# Altium schematic sheet PowerSupply_Schematic.SchDoc
size A3; SheetNumber: 1; SheetTotal: 3; SPICEModelCacheCBIUOFXF: <root> / <DocumentId>CBIUOFXF</DocumentId> / <CacheFrame Number="0"> / <Model Name="860020375017_1mf" Kind="CKT"> / <Text>******* / .subckt 860020375017_1mF 1 2 / Rser 1 3 0.071 / Lser 2 4 0.0000000243 / C1 3 4 0.001 / Rpar 3 4 100000 / .ends 860020375017_1mF</Text> / </Model> / <Model Name="860020372001_10uf" Kind="CKT"> / <Text>******* / .subckt 860020372001_10uF 1 2 / Rser 1 3 1.95182658193 / Lser 2 4 4.159236184E-09 / C1 3 4 0.00001 / Rpar 3 4 5333333.33333333 / .ends 860020372001_10uF</Text> / </Model> / </CacheFrame> / </root>
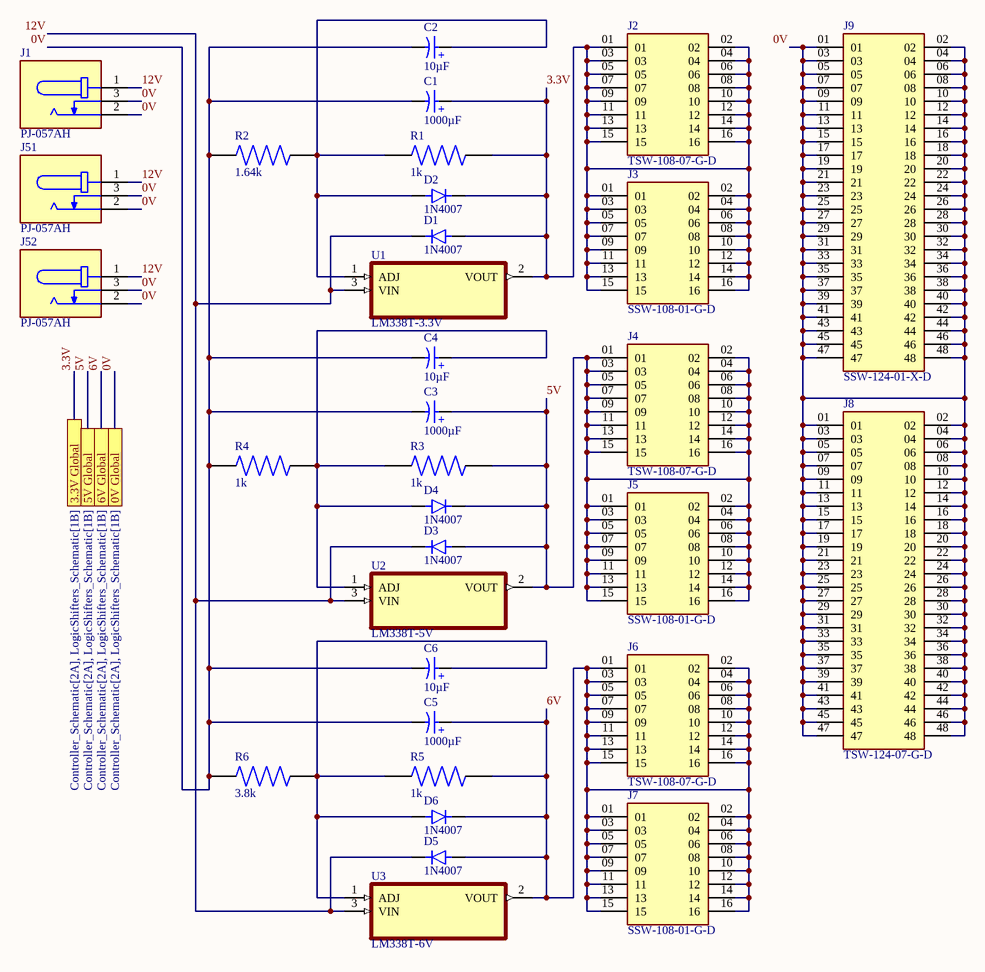
[diagram p0: PowerSupply_Schematic.SchDoc]

## Parts
C1  1000µF  [WCAP-ATG5_D10H12.5]
C2  10µF  [WCAP-ATG5_D5H11]
C3  1000µF  [WCAP-ATG5_D10H12.5]
C4  10µF  [WCAP-ATG5_D5H11]
C5  1000µF  [WCAP-ATG5_D10H12.5]
C6  10µF  [WCAP-ATG5_D5H11]
D1  1N4007  [DIOAD1060W80L520D270]
D2  1N4007  [DIOAD1060W80L520D270]
D3  1N4007  [DIOAD1060W80L520D270]
D4  1N4007  [DIOAD1060W80L520D270]
D5  1N4007  [DIOAD1060W80L520D270]
D6  1N4007  [DIOAD1060W80L520D270]
J1  PJ-057AH  [CUI_PJ-057AH]
J2  TSW-108-07-G-D  [SAMTEC_TSW-108-07-G-D]
J3  SSW-108-01-G-D  [SAMTEC_SSW-108-01-G-D]
J4  TSW-108-07-G-D  [SAMTEC_TSW-108-07-G-D]
J5  SSW-108-01-G-D  [SAMTEC_SSW-108-01-G-D]
J6  TSW-108-07-G-D  [SAMTEC_TSW-108-07-G-D]
J7  SSW-108-01-G-D  [SAMTEC_SSW-108-01-G-D]
J8  TSW-124-07-G-D  [SAMTEC_TSW-124-07-G-D]
J9  SSW-124-01-X-D  [SAMTEC_SSW-124-01-X-D]
J51  PJ-057AH  [CUI_PJ-057AH]
J52  PJ-057AH  [CUI_PJ-057AH]
R1  1k  [RESAD700W45L350D185]
R2  1.64k  [RESAD700W45L350D185]
R3  1k  [RESAD700W45L350D185]
R4  1k  [RESAD700W45L350D185]
R5  1k  [RESAD700W45L350D185]
R6  3.8k  [RESAD700W45L350D185]
U1  LM338T-3.3V  [TO254P1054X470X1955-3]
U2  LM338T-5V  [TO254P1054X470X1955-3]
U3  LM338T-6V  [TO254P1054X470X1955-3]

## Ports
0V Global (see Controller_Schematic[2A], LogicShifters_Schematic[1B]), 3.3V Global (see Controller_Schematic[2A], LogicShifters_Schematic[1B]), 5V Global (see Controller_Schematic[2A], LogicShifters_Schematic[1B]), 6V Global (see Controller_Schematic[2A], LogicShifters_Schematic[1B])

## Nets
0V: C1.2(N) C2.2(N) C3.2(N) C4.2(N) C5.2(N) C6.2(N) J1.2 J1.3 J8.01 J8.02 J8.03 J8.04 J8.05 J8.06 J8.07 J8.08 J8.09 J8.10 J8.11 J8.12 J8.13 J8.14 J8.15 J8.16 J8.17 J8.18 J8.19 J8.20 J8.21 J8.22 J8.23 J8.24 J8.25 J8.26 J8.27 J8.28 J8.29 J8.30 J8.31 J8.32 J8.33 J8.34 J8.35 J8.36 J8.37 J8.38 J8.39 J8.40 J8.41 J8.42 J8.43 J8.44 J8.45 J8.46 J8.47 J8.48 J9.01 J9.02 J9.03 J9.04 J9.05 J9.06 J9.07 J9.08 J9.09 J9.10 J9.11 J9.12 J9.13 J9.14 J9.15 J9.16 J9.17 J9.18 J9.19 J9.20 J9.21 J9.22 J9.23 J9.24 J9.25 J9.26 J9.27 J9.28 J9.29 J9.30 J9.31 J9.32 J9.33 J9.34 J9.35 J9.36 J9.37 J9.38 J9.39 J9.40 J9.41 J9.42 J9.43 J9.44 J9.45 J9.46 J9.47 J9.48 J51.2 J51.3 J52.2 J52.3 R2.1 R4.1 R6.1 ; port 0V Global
3.3V: C1.1(P) D1.A D2.C J2.01 J2.02 J2.03 J2.04 J2.05 J2.06 J2.07 J2.08 J2.09 J2.10 J2.11 J2.12 J2.13 J2.14 J2.15 J2.16 J3.01 J3.02 J3.03 J3.04 J3.05 J3.06 J3.07 J3.08 J3.09 J3.10 J3.11 J3.12 J3.13 J3.14 J3.15 J3.16 R1.2 U1.2(VOUT) ; port 3.3V Global
5V: C3.1(P) D3.A D4.C J4.01 J4.02 J4.03 J4.04 J4.05 J4.06 J4.07 J4.08 J4.09 J4.10 J4.11 J4.12 J4.13 J4.14 J4.15 J4.16 J5.01 J5.02 J5.03 J5.04 J5.05 J5.06 J5.07 J5.08 J5.09 J5.10 J5.11 J5.12 J5.13 J5.14 J5.15 J5.16 R3.2 U2.2(VOUT) ; port 5V Global
6V: C5.1(P) D5.A D6.C J6.01 J6.02 J6.03 J6.04 J6.05 J6.06 J6.07 J6.08 J6.09 J6.10 J6.11 J6.12 J6.13 J6.14 J6.15 J6.16 J7.01 J7.02 J7.03 J7.04 J7.05 J7.06 J7.07 J7.08 J7.09 J7.10 J7.11 J7.12 J7.13 J7.14 J7.15 J7.16 R5.2 U3.2(VOUT) ; port 6V Global
12V: D1.C D3.C D5.C J1.1 J51.1 J52.1 U1.3(VIN) U2.3(VIN) U3.3(VIN)
NetC2_1: C2.1(P) D2.A R1.1 R2.2 U1.1(ADJ)
NetC4_1: C4.1(P) D4.A R3.1 R4.2 U2.1(ADJ)
NetC6_1: C6.1(P) D6.A R5.1 R6.2 U3.1(ADJ)

## Notes on the sheet
- (in symbol 860020372001) +
- (in symbol 860020375017) +

## Library data of the parts
C1 C3 C5 = 860020375017: WCAP-ATG5 Aluminum Electrolytic Capacitor, Radial, THT, D10 x H12.5mm, 1000µF, 16V; Manufacturer: Wurth Elektronik; Capacitance Tolerance: +/-20%; Dissipation Factor: 15%; Endurance: 2000h; Leakage Current: 160µA; Ripple Current: 540mA; Technical Reference: ATDF125102M016DSPA9B000; Manufacturer Part Number: 860020375017; Category: Aluminum Electrolytic Capacitors; Match Code: WCAP-ATG5; ComponentLink1Description: Website Link; ComponentLink1URL: https://www.we-online.com/redexpert/article/860020375017?ad; ComponentLink2Description: Datasheet Link; ComponentLink2URL: https://www.we-online.com/redexpert/spec/860020375017?ad; Mount: Through Hole; Operating Temperature Max: 105°C; Operating Temperature Min: -40°C; Packaging: Ammo Pack; Height: 12.5mm; Diameter: 10mm; Capacitance: 1000µF; Rated Voltage (DC): 16V
C2 C4 C6 = 860020372001: WCAP-ATG5 Aluminum Electrolytic Capacitor, Radial, THT, D5 x H11mm, 10µF, 16V; Manufacturer: Wurth Elektronik; Capacitance Tolerance: +/-20%; Dissipation Factor: 15%; Endurance: 2000h; Leakage Current: 3µA; Ripple Current: 35mA; Technical Reference: ATDC110100M016DSPA3B000; Manufacturer Part Number: 860020372001; Category: Aluminum Electrolytic Capacitors; Match Code: WCAP-ATG5; ComponentLink1Description: Website Link; ComponentLink1URL: https://www.we-online.com/redexpert/article/860020372001?ad; ComponentLink2Description: Datasheet Link; ComponentLink2URL: https://www.we-online.com/redexpert/spec/860020372001?ad; Mount: Through Hole; Operating Temperature Max: 105°C; Operating Temperature Min: -40°C; Packaging: Ammo Pack; Height: 11mm; Diameter: 5mm; Capacitance: 10µF; Rated Voltage (DC): 16V
D1-D6 = 1N4007: Rectifier Silicon, 1000V, 1 A, DO-41 Case, Solder Leads, 1N Series | NTE Electronics Inc. 1N4007; MF: NTE Electronics, Inc.; SnapEDA_Link: https://www.snapeda.com/parts/1N4007/NTE+Electronics/view-part/?ref=snap; Package: DO-41 NTE Electronics; Value: *; MP: 1N4007; Check_prices: https://www.snapeda.com/parts/1N4007/NTE+Electronics/view-part/?ref=eda
J1 J51 J52 = PJ-057AH: 2.0 x 6.3 mm, 5.0 A, Horizontal, Through Hole, Pick-n-Place Top, Dc Power Jack Connector; MF: Same Sky; SnapEDA_Link: https://www.snapeda.com/parts/PJ-057AH/Same+Sky/view-part/?ref=snap; Package: None; Value: *; MP: PJ-057AH; Check_prices: https://www.snapeda.com/parts/PJ-057AH/Same+Sky/view-part/?ref=eda
J2 J4 J6 = TSW-108-07-G-D: MF: Samtec; MP: TSW-108-07-G-D; Price: None; Package: None; Value: *; Availability: Unavailable
J3 J5 J7 = SSW-108-01-G-D: MF: Samtec; Package: None; Price: None; Value: *; MP: SSW-108-01-G-D; Availability: Unavailable
J8 = TSW-124-07-G-D: MF: Samtec; Price: None; Value: *; MP: TSW-124-07-G-D; Package: None; Availability: Unavailable
J9 = SSW-124-01-X-D: MF: Samtec; Package: None; Price: None; Value: *; MP: SSW-124-01-X-D; Availability: Unavailable
R1-R6 = 3-1623927-1: 1 MOhms Â±5% 0.25W, 1/4W Through Hole Resistor Axial - Carbon Film; MF: TE Connectivity; SnapEDA_Link: https://www.snapeda.com/parts/3-1623927-1/TE+Connectivity/view-part/?ref=snap; Package: None; Value: *; MP: 3-1623927-1; Check_prices: https://www.snapeda.com/parts/3-1623927-1/TE+Connectivity/view-part/?ref=eda
U1-U3 = LM338T: 5-A, 40-V, low-IQ, adjustable linear voltage regulator 3-TO-220 0 to 125; MF: Texas Instruments; SnapEDA_Link: https://www.snapeda.com/parts/LM338T/Texas+Instruments/view-part/?ref=snap; Package: TO-220-3 Texas Instruments; Value: *; MP: LM338T; Check_prices: https://www.snapeda.com/parts/LM338T/Texas+Instruments/view-part/?ref=eda